# EAGLE design ESP32_EVKIT_v1.0 (EAGLE 6.5.0)
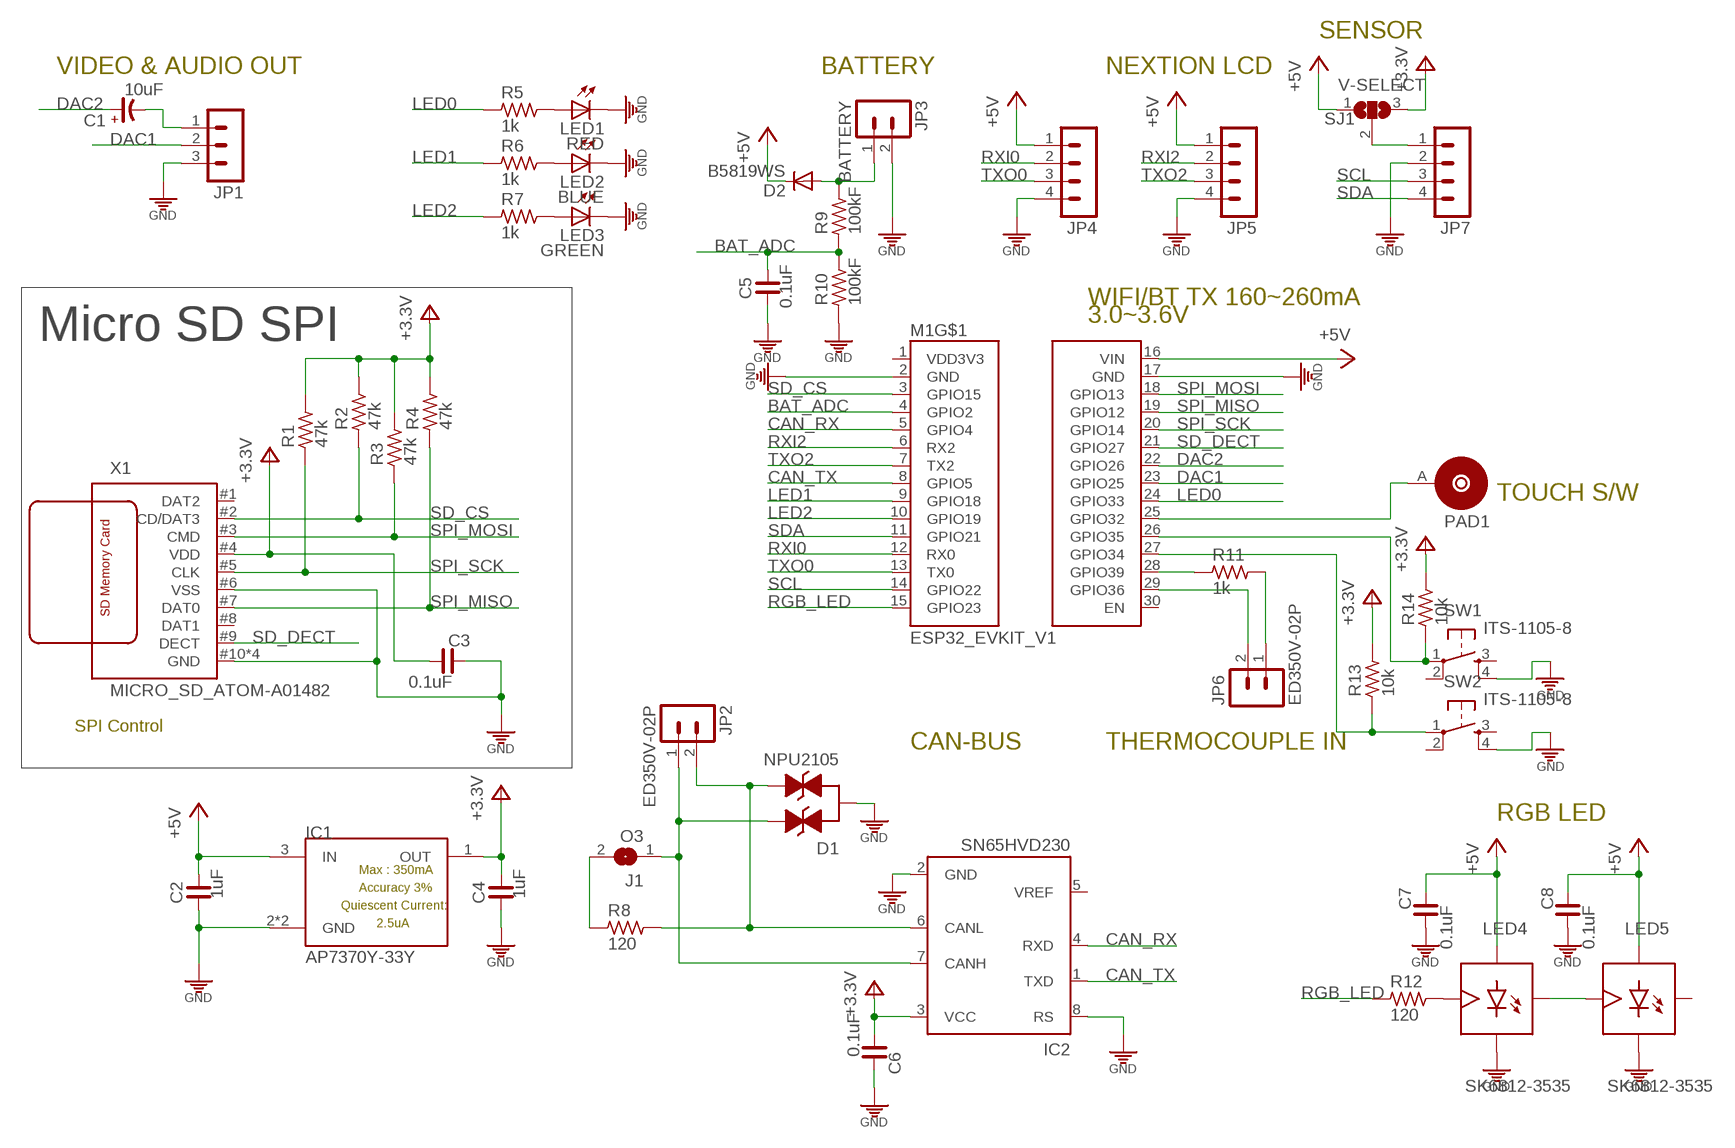
[diagram p0: schematic, sheet 1]

## Parts
C1  10uF  CP_2012  [C2012/T]
C2  1uF  C_0603  [C0603]
C3  0.1uF  C_0603  [C0603]
C4  1uF  C_0603  [C0603]
C5  0.1uF  C_0603  [C0603]
C6  0.1uF  C_0603  [C0603]
C7  0.1uF  C_0603  [C0603]
C8  0.1uF  C_0603  [C0603]
D1  NPU2105  [SOT23@2]
D2  B5819WS  B5189WWS  [SOD323-W]
IC1  AP7370Y-33Y  AP7370Y  [SOT89]
IC2  SN65HVD230  PCA82C250T  [SO8]
J1  O3  SJ  [SJ]
JP1  MA03-1DEF  [MA03]
JP2  ED350V-02P  MA02ED350V-02P  [ED350V-02P]
JP3  BATTERY  MA0253398  [53398-02]
JP4  MA04-1SMALL  [MA04-1-S]
JP5  MA04-1SMALL  [MA04-1-S]
JP6  ED350V-02P  MA02ED350V-02P  [ED350V-02P]
JP7  MA04-1SMALL  [MA04-1-S]
LED1  RED  LEDSMD-1608  [LED-1608]
LED2  BLUE  LEDSMD-1608  [LED-1608]
LED3  GREEN  LEDSMD-1608  [LED-1608]
LED4  SK6812-3535  SK68123535  [LED3535]
LED5  SK6812-3535  SK68123535  [LED3535]
M1  ESP32_EVKIT_V1  [ESP32_DEVKIT_V1_DOIT]
PAD1  TOUCH_PAD01  [TOUCH_PAD1]
R1  47k  R_0603  [R0603]
R2  47k  R_0603  [R0603]
R3  47k  R_0603  [R0603]
R4  47k  R_0603  [R0603]
R5  1k  R_0603  [R0603]
R6  1k  R_0603  [R0603]
R7  1k  R_0603  [R0603]
R8  120  R_0603  [R0603]
R9  100kF  R_0603  [R0603]
R10  100kF  R_0603  [R0603]
R11  1k  R_0603  [R0603]
R12  120  R_0603  [R0603]
R13  10k  R_0603  [R0603]
R14  10k  R_0603  [R0603]
SJ1  V-SELECT  SOLDERJUMPER_2WAYS  [SJ_3]
SW1  ITS-1105-8  ITS-1105  [ITS-1105]
SW2  ITS-1105-8  ITS-1105  [ITS-1105]
X1  MICRO_SD_ATOM-A01482  [ATOM-A01482]

## Nets
3V3: C3.2 C4.1 C6.2 IC1.1(OUT) IC2.3(VCC) R1.2 R2.2 R3.2 R4.2 R13.2 R14.2 SJ1.3 X1.#4(VDD) ; supply symbol labelled +3V3
+5V: C2.1 C7.1 C8.1 D2.C IC1.3(IN) JP4.1 JP5.1 LED4.4(VDD) LED5.4(VDD) M1.16(VIN) SJ1.1
BAT_ADC: C5.1 M1.4(GPIO2) R9.1 R10.2
CAN_RX: IC2.4(RXD) M1.5(GPIO4)
CAN_TX: IC2.1(TXD) M1.8(GPIO5)
CANH: D1.G(PIN1) IC2.7(CANH) J1.1 JP2.1
CANL: D1.S(PIN2) IC2.6(CANL) JP2.2 R8.2
DAC1: JP1.2 M1.23(GPIO25)
DAC2: C1.+ M1.22(GPIO26)
GND: C2.2 C3.1 C4.2 C5.2 C6.1 C7.2 C8.2 D1.D(PIN3) IC1.2(GND) IC1.2@1(GND) IC2.2(GND) IC2.8(RS) JP1.3 JP3.2 JP4.4 JP5.4 JP7.2 LED1.C LED2.C LED3.C LED4.2(VSS) LED5.2(VSS) M1.2(GND) M1.17(GND) R10.1 SW1.4 SW2.4 X1.#6(VSS) X1.#10(GND) X1.#10@1(GND) X1.#10@(GND) X1.#13(GND)
LED0: M1.24(GPIO33) R5.1
LED1: M1.9(GPIO18) R6.1
LED2: M1.10(GPIO19) R7.1
N$1: LED4.3(DIN) R12.2
N$2: LED1.A R5.2
N$3: LED2.A R6.2
N$4: LED3.A R7.2
N$5: M1.25(GPIO32) PAD1.A
N$6: J1.2 R8.1
N$7: M1.28(GPIO39) R11.1
N$8: LED4.1(DOUT) LED5.3(DIN)
N$9: JP6.2 M1.29(GPIO36)
N$10: D2.A JP3.1 R9.2
N$12: JP6.1 R11.2
N$14: C1.- JP1.1
N$15: JP7.1 SJ1.2
N$34: M1.26(GPIO35) R14.1 SW1.1
N$35: M1.27(GPIO34) R13.1 SW2.1
RGB_LED: M1.15(GPIO23) R12.1
RXI0: JP4.2 M1.12(RX0)
RXI2: JP5.2 M1.6(RX2)
SCL: JP7.3 M1.14(GPIO22)
SD_CS: M1.3(GPIO15) R2.1 X1.#2(CD/DAT3)
SD_DECT: M1.21(GPIO27) X1.#9(DECT)
SDA: JP7.4 M1.11(GPIO21)
SPI_MISO: M1.19(GPIO12) R4.1 X1.#7(DAT0)
SPI_MOSI: M1.18(GPIO13) R3.1 X1.#3(CMD)
SPI_SCK: M1.20(GPIO14) R1.1 X1.#5(CLK)
TXO0: JP4.3 M1.13(TX0)
TXO2: JP5.3 M1.7(TX2)
Unconnected: IC2.5(VREF) LED5.1(DOUT) M1.1(VDD3V3) M1.30(EN) SW1.2 SW1.3 SW2.2 SW2.3 X1.#1(DAT2) X1.#8(DAT1)

## Notes on the sheet
- SENSOR
- VIDEO & AUDIO OUT | BATTERY | NEXTION LCD
- WIFI/BT TX 160~260mA
- 3.0~3.6V
- Micro SD SPI
- TOUCH S/W
- SPI Control
- CAN-BUS | THERMOCOUPLE IN
- RGB LED

## Library data of the parts
C1 = cona_lib:CP_: POLARIZED CAP
C2-C8 = cona_lib:C_: NON-POLARIZED CAP
D1 = cona_lib:NPU2105
D2 = cona_lib:B5189W
IC1 = cona_lib:AP7370
IC2 = cona_lib:PCA82C250: CAN CONTROLLER INTERFACE
J1 = cona_lib:SJ: SMD solder JUMPER
JP1 = cona_lib:MA03-1: PIN HEADER
JP2 JP3 JP6 = cona_lib:MA02
JP4 JP5 JP7 = cona_lib:MA04-1: PIN HEADER
LED1-LED3 = cona_lib:LED: LED OSRAM: - CHIPLED LG R971, LG N971, LY N971, LG Q971, LY Q971, LO R971, LY R971 LH N974, LH R974 LS Q976, LO Q976, LY Q976 LO Q996 - Hyper CHIPLED LW Q18S LB Q993, LB Q99A, LB R99A - SideLED LS A670, LO A670, LY A670, LG A670, LP A670 LB A673, LV A673, LT A673, LW A673 LH A674 LY A675 LS A676, LA A676, LO A676, LY A676, LW A676 LS A679, LY A679, LG A679 - Hyper Micro SIDELED® LS Y876, LA Y876, LO Y876, LY Y876 LT Y87S - SmartLED LW L88C, LW L88S LB L89C, LB L89S, LG L890 LS L89K, LO L89K, LY L89K LS L896, LA L896, LO L896, LY L896 - TOPLED LS T670, LO T670, LY T670, LG T670, LP T670 LSG T670, LSP T670, LSY T670, LOP T670, LYG T670 LG T671, LOG T671, LSG T671 LB T673, LV T673, LT T673, LW T673 LH T674 LS T676, LA T676, LO T676, LY T676, LB T676, LH T676, LSB T676, LW T676 LB T67C, LV T67C, LT T67C, LS T67K, LO T67K, LY T67K, LW E67C LS E67B, LA E67B, LO E67B, LY E67B, LB E67C, LV E67C, LT E67C LW T67C LS T679, LY T679, LG T679 LS T770, LO T770, LY T770, LG T770, LP T770 LB T773, LV T773, LT T773, LW T773 LH T774 LS E675, LA E675, LY E675, LS T675 LS T776, LA T776, LO T776, LY T776, LB T776 LHGB T686 LT T68C, LB T68C - Hyper Mini TOPLED® LB M676 - Mini TOPLED Santana® LG M470 LS M47K, LO M47K, LY M47K Source: http://www.osram.convergy.de LUXEON: - LUMILED® LXK2-PW12-R00, LXK2-PW12-S00, LXK2-PW14-U00, LXK2-PW14-V00 LXK2-PM12-R00, LXK2-PM12-S00, LXK2-PM14-U00 LXK2-PE12-Q00, LXK2-PE12-R00, LXK2-PE12-S00, LXK2-PE14-T00, LXK2-PE14-U00 LXK2-PB12-K00, LXK2-PB12-L00, LXK2-PB12-M00, LXK2-PB14-N00, LXK2-PB14-P00, LXK2-PB14-Q00 LXK2-PR12-L00, LXK2-PR12-M00, LXK2-PR14-Q00, LXK2-PR14-R00 LXK2-PD12-Q00, LXK2-PD12-R00, LXK2-PD12-S00 LXK2-PH12-R00, LXK2-PH12-S00 LXK2-PL12-P00, LXK2-PL12-Q00, LXK2-PL12-R00 Source: www.luxeon.com KINGBRIGHT: KA-3528ASYC Source: www.kingbright.com
LED4 LED5 = cona_lib:SK6812
M1 = cona_lib:ESP32_EVKIT_V1
PAD1 = cona_lib:TOUCH_PAD
R1-R14 = cona_lib:R_: RESISTOR
SJ1 = DIYdrones3:SOLDERJUMPER_2WAY: Solder Jumper 2 way solder jumper
SW1 SW2 = switch-tact:ITS-1105
X1 = cona_lib:MICRO_SD_ATOM-A01482

## Net classes
0 default: clearance 0.152 mm
1 vcc: clearance 0.2 mm
2 GND: width 0.2 mm, clearance 0.152 mm

## Board
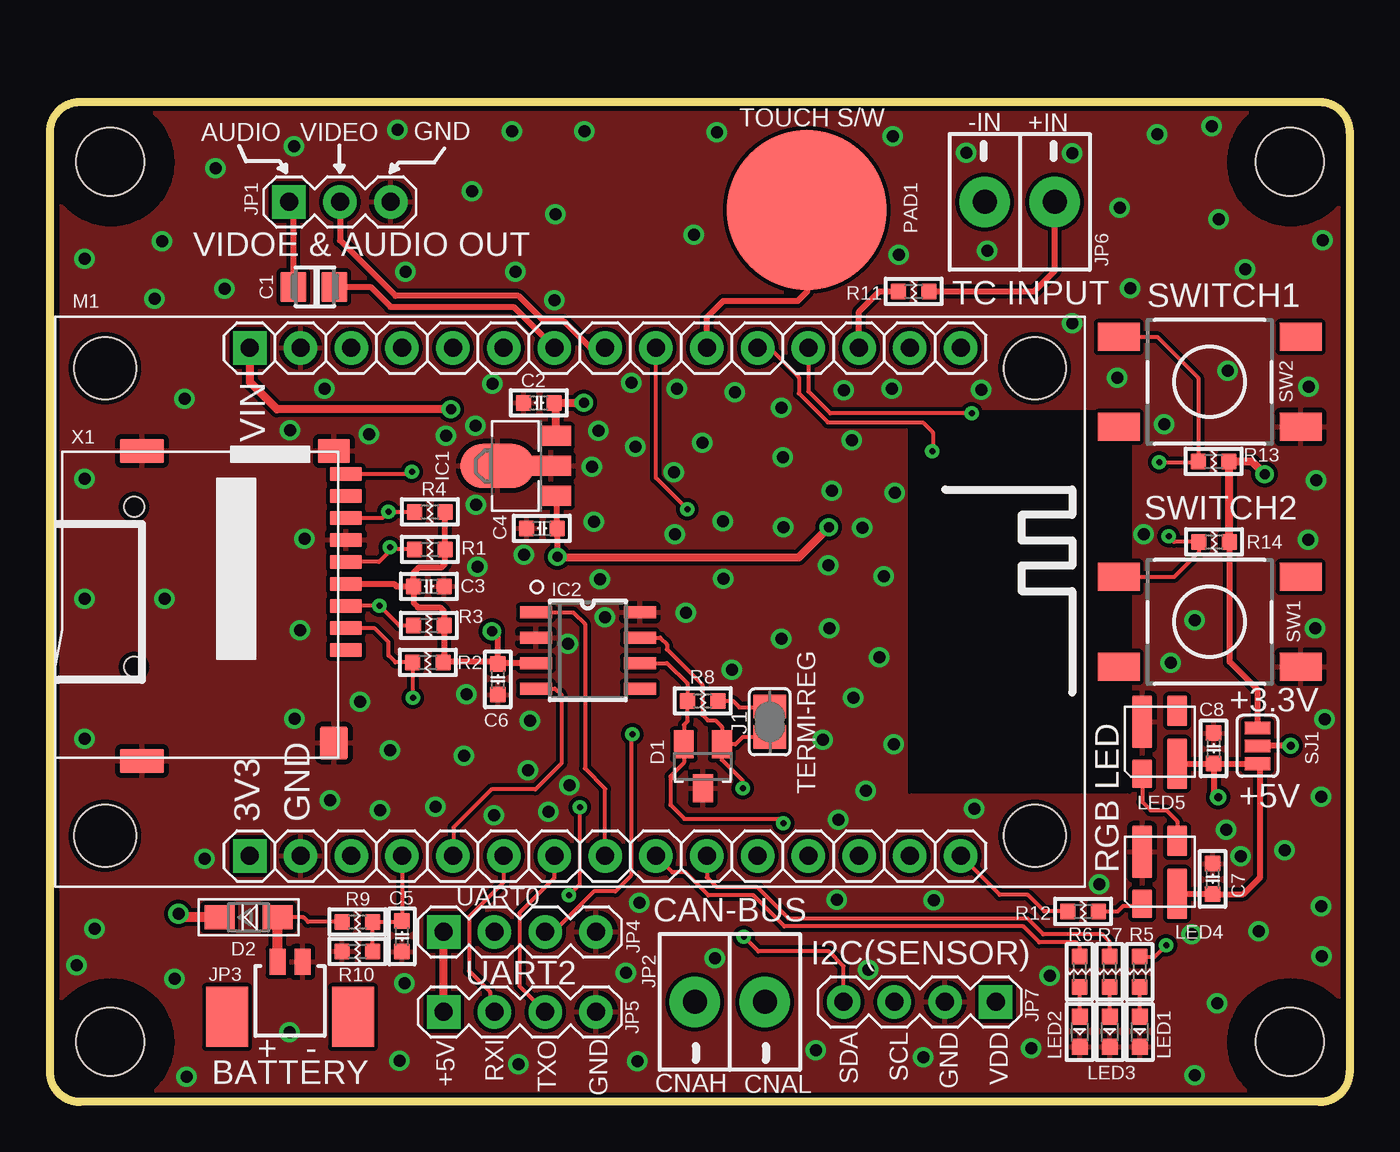
[diagram p1: board, top side]
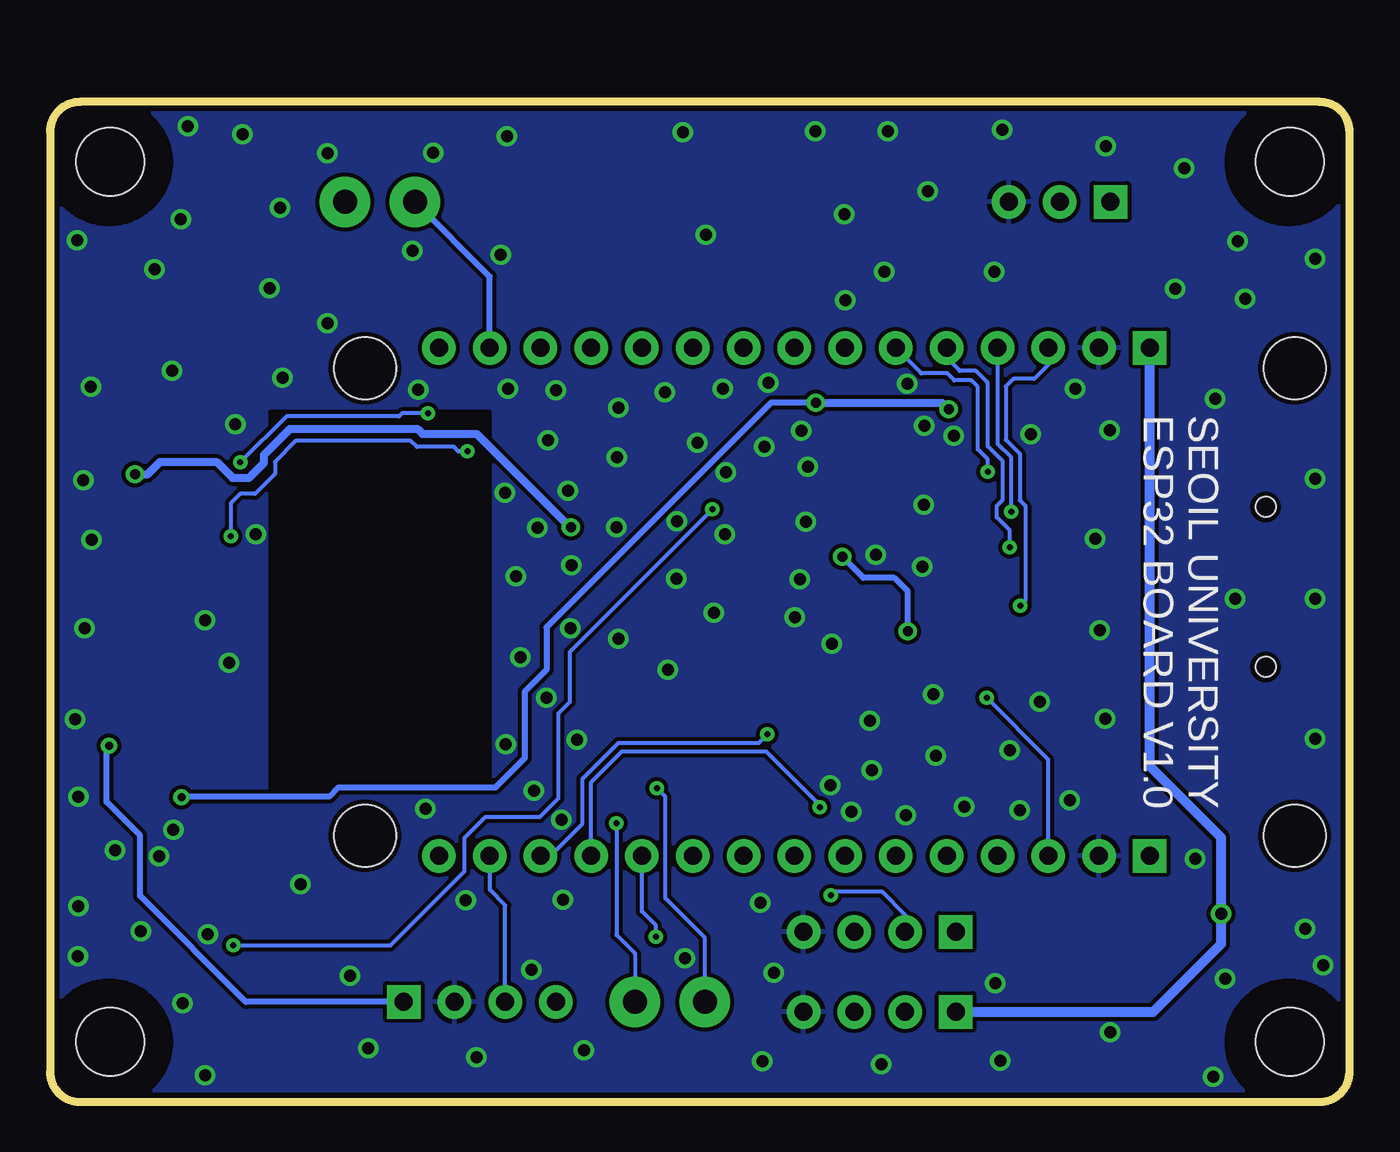
[diagram p2: board, bottom side, seen from below]

Size 65 x 50 mm. Coordinates in mm from the lower left corner, seen from the top.
Outline: 0,1.5 0,48.5 arc-90 1.5,50 63.5,50 arc-90 65,48.5 65,1.5 arc-90 63.5,0 1.5,0 arc-90 0,1.5
Copper layers (1+16): Top 0.035mm / dielectric 1.5mm / Bottom 0.035mm
Design rules "default *": minimum track width 0.2mm, minimum drill 0.3mm, track to track 0.2mm, track to pad 0.2mm, pad to pad 0.2mm, via to via 0.2mm, smd to smd 0.2mm, copper to edge 10mil, drill to drill 0.2mm, minimum pad ring 10mil, minimum via ring 8mil, stop-mask expansion 4mil, vias tented up to drill 1mm, thermal gap 10mil
Holes 3.4 mm at 3,47 62,47 62,3 3,3

### Footprints (pad centres in the part's own frame; a part is rotated, then mirrored left to right if it is on the bottom)
C2012/T = smd 1.3 x 1.5: + 1.016,0; - -1.016,0
C0603 = smd 0.8 x 0.8: 1 -0.762,0; 2 0.762,0
SOT23@2 = smd 1 x 1.4: D 0,-1.1; G 0.95,1.1; S -0.95,1.1
SOD323-W = smd 1.5 x 1.2: A 1.45,0; C -1.45,0
SOT89 = smd 1 x 1.5: 1 -1.499,-1.981; 3 1.499,-1.981 | smd 1 x 2: 2 0,-1.727 | smd 2.2 x 3.7: 2@1 0,0.94
SO8 = smd 0.6 x 1.6: 1 -1.905,-2.6; 2 -0.635,-2.6; 3 0.635,-2.6; 4 1.905,-2.6; 5 1.905,2.6; 6 0.635,2.6; 7 -0.635,2.6; 8 -1.905,2.6
SJ = smd 1.168 x 1.6: 1 -0.762,0; 2 0.762,0
MA03 = drill 0.9 pad 1.676 square: 1 -2.54,0 | drill 0.9 pad 1.676: 2 0,0; 3 2.54,0
ED350V-02P = drill 1.2 pad 2.54: 1 -1.75,0; 2 1.75,0
53398-02 = smd 0.8 x 1.3: 1 -0.625,0; 2 0.625,0 | smd 2.1 x 3: P$1 -3.15,-2.75; P$2 3.15,-2.75
MA04-1-S = drill 0.9 pad 1.676 square: 1 -3.81,0 | drill 0.9 pad 1.676: 2 -1.27,0; 3 1.27,0; 4 3.81,0
LED-1608 = smd 0.8 x 0.8: A -0.75,0; C 0.75,0
LED3535 = smd 1.5 x 1: 1 -1.55,0.875 | smd 2.6 x 1: 2 -1,-0.875 | smd 1.4 x 1: 3 1.6,-0.875 | smd 2.5 x 1: 4 1.1,0.875
ESP32_DEVKIT_V1_DOIT = drill 0.9 pad 1.676 square: 1 -12.7,16.01; 16 12.7,16.01 | drill 0.9 pad 1.676: 2 -12.7,13.47; 3 -12.7,10.93; 4 -12.7,8.39; 5 -12.7,5.85; 6 -12.7,3.31; 7 -12.7,0.77; 8 -12.7,-1.77; 9 -12.7,-4.31; 10 -12.7,-6.85; 11 -12.7,-9.39; 12 -12.7,-11.93; 13 -12.7,-14.47; 14 -12.7,-17.01; 15 -12.7,-19.55; 17 12.7,13.47; 18 12.7,10.93; 19 12.7,8.39; 20 12.7,5.85; 21 12.7,3.31; 22 12.7,0.77; 23 12.7,-1.77; 24 12.7,-4.31; 25 12.7,-6.85; 26 12.7,-9.39; 27 12.7,-11.93; 28 12.7,-14.47; 29 12.7,-17.01; 30 12.7,-19.55 | hole 3.1: 11.685,-23.25; -11.685,-23.25; 11.685,23.25; -11.685,23.25
TOUCH_PAD1 = smd 8 x 8: A -0.75,0
R0603 = smd 0.8 x 0.8: 1 -0.762,0; 2 0.762,0
SJ_3 = smd 0.635 x 1.27: 1 -0.889,0; 2 0,0; 3 0.889,0
ITS-1105 = smd 2.1 x 1.4: 1 -4.55,2.25; 2 4.55,2.25; 3 -4.55,-2.25; 4 4.55,-2.25
ATOM-A01482 = smd 0.7 x 1.6: #1 2.2,0; #2 1.1,0; #3 0,0; #4 -1.1,0; #5 -2.2,0; #6 -3.3,0; #7 -4.4,0; #8 -5.5,0; #9 -6.6,0 | smd 1.2 x 1.6: #10 -7.75,-0.6 | smd 1.2 x 2.2: #10@ -7.75,-10.2; #10@1 7.75,-10.2 | smd 1.6 x 1.4: #13 6.85,-0.6 | hole 1: -4.95,-10.6; 3.05,-10.6

### Placement (x,y rotation side)
C1  13.2,40.75 0 top
C2  24.45,34.95 180 top
C3  18.95,25.77 180 top
C4  24.6,28.68 180 top
C5  17.6,8.27 270 top
C6  22.4,21.12 90 top
C7  58.15,11.15 90 top
C8  58.2,17.68 90 top
D1  32.65,16.77 0 top
D2  9.93,9.22 0 top
IC1  23.32,31.8 90 top
IC2  26.9,22.57 270 top
J1  36,19 90 top
JP1  14.5,45 0 top
JP2  34,5 0 top
JP3  12,7 0 top
JP4  23.5,8.5 0 top
JP5  23.5,4.5 0 top
JP6  48.5,45 180 top
JP7  43.5,5 180 top
LED1  54.5,3.5 270 top
LED2  51.5,3.5 270 top
LED3  53,3.5 270 top
LED4  55.5,11.5 270 top
LED5  55.5,18 270 top
M1  26,25 90 top
PAD1  38.6,44.6 0 top
R1  19,27.62 0 top
R2  18.9,21.98 0 top
R3  18.95,23.82 0 top
R4  19,29.5 0 top
R5  54.5,6.5 270 top
R6  51.5,6.5 270 top
R7  53,6.5 270 top
R8  32.65,20.05 180 top
R9  15.38,9 180 top
R10  15.38,7.52 0 top
R11  43.2,40.52 0 top
R12  51.67,9.53 0 top
R13  58.2,32.02 0 top
R14  58.23,28 0 top
SJ1  60.4,17.8 90 top
SW1  58,24 0 top
SW2  58,36 0 top
X1  14.8,24.8 270 top

### Tracks (layer width: path | path; a pad name or v marks a point on that pad's centre or on a via)
3V3  (via drill 0.5)
  Top 0.3: X1.#4 17.2,25.9 17.32,25.77 C3.2 | C3.2 18.19,24.94 18.4,24.73 19.5,24.73 19.7,24.52 19.7,23.84 R3.2 19.71,22.02 | 19.71,22.02 R2.2 | R4.2 R1.2 19.75,26.9 19.57,26.73 18.45,26.73 18.19,26.46 C3.2 | 19.71,22.02 22.26,22.02 C6.2 | IC2.3 22.45,21.94 C6.2 | C6.2 22.4,23.23 v22.1,23.52 | v25.38,27.25 25.38,28.66 C4.1 25.36,30.25 IC1.1 | SJ1.3 60.4,20.6 59,22 59,27.99 R14.2
  Top 0.4: R14.2 58.96,28.02 R13.2 60.1,32.02 v60.75,31.38 | v25.38,27.25 25.4,27.23 37.45,27.23 v38.95,28.73
  Bottom 0.3: v22.1,23.52 22.1,25.52 22.77,26.2 24.32,26.2 v25.38,27.25
  Bottom 0.4: v38.95,28.73 39,28.73 43.67,33.4 46.38,33.4 46.62,33.65 53,33.65 54.3,32.35 54.3,31.95 55.05,31.2 55.88,31.2 56.67,32 59.5,32 60.12,31.38 v60.75,31.38
+5V  (via drill 0.4, 0.5, 0.6)
  Top 0.3: LED4.4 58.14,10.4 C7.1 59.69,10.39 60.52,11.22 60.52,16.79 SJ1.1 C8.1 | LED5.4 58.19,16.9 C8.1 | C8.1 58.2,15.45 v58.42,15.22
  Top 0.4: IC1.3 25.31,34.86 C2.1 v26.7,34.95 | v20.05,34.62 11.35,34.62 10,35.98 M1.16 | JP5.1 JP4.1
  Top 0.5: D2.C 6.6,9.22 v6.42,9.4
  Bottom 0.3: v26.7,34.95 28.95,34.95 40.17,23.73 40.17,21.6 41.25,20.52 41.25,17.2 42.73,15.72 50.58,15.72 51.02,15.28 58.38,15.28 v58.42,15.22
  Bottom 0.4: v26.7,34.95 20.38,34.95 v20.05,34.62
  Bottom 0.5: M1.16 10,16.77 6.42,13.2 v6.42,9.4 6.42,7.9 9.82,4.5 JP5.1
BAT_ADC
  Top 0.2: R10.2 R9.1 17.56,9 C5.1 M1.4
CAN_RX
  Top 0.2: IC2.4 25.25,20.67 25.57,20.35 25.57,16.93 24.27,15.62 22.07,15.62 20.18,13.72 20.18,12.32 M1.5
CAN_TX
  Top 0.2: M1.8 27.77,15.65 26.75,16.68 26.75,23.9 26.17,24.48 IC2.1
CANH  (via drill 0.3)
  Top 0.2: v34.65,15.68 34.65,16.05 33.6,17.1 D1.G | IC2.7 30.52,23.21 30.85,22.88 30.85,22.62 32.62,20.85 32.62,19.35 32.9,19.07 33.27,19.07 33.6,18.75 D1.G | J1.1 34.64,18.24 34.27,17.88 D1.G
  Bottom 0.2: JP2.1 32.25,8.2 34.23,10.18 34.23,15.25 v34.65,15.68
CANL  (via drill 0.3)
  Top 0.2: IC2.6 30.86,21.94 31.88,20.93 31.88,20.06 R8.2 31.89,19.04 31.7,18.85 D1.S 31.7,16.95 31.02,16.27 31.02,14.85 31.73,14.15 36.45,14.15 v36.67,13.93
  Bottom 0.2: v36.67,13.93 36.67,8.35 35.75,7.43 JP2.2
DAC1
  Top 0.3: JP1.2 14.5,43.08 17.27,40.3 23.43,40.3 24.7,39.02 25.7,39.02 27.02,37.7 M1.23
DAC2
  Top 0.3: C1.+ 16.02,40.75 17.02,39.75 23.18,39.75 M1.22
GND  (via drill 0.6)
  other vias: 15.5,20 7.72,12.15 2.23,8.65 6.22,6.15 1.73,18.15 5.72,25.15 12.72,28.15 12.22,19.15 1.73,31.15 1.73,25.15 6.72,35.15 1.73,42.15 8.72,40.65 13.72,35.65 15.95,33.38 12,33.58 12.5,23.57 8.28,46.67 17.38,48.6 12.2,47.77 21.1,45.52 17.77,41.5 19.8,33.3 21.27,33.8 21.3,29.85 23.7,27.35 27.1,31.75 27.43,33.55 27.2,29 29.27,32.75 29.07,35.95 22.12,35.9 23.27,41.5 25.23,40.08 23.1,48.52 26.73,48.52 25.27,44.38 5.6,43.02 14,15.07 16.5,14.57 17,17.57 20.82,20.38 24,19.05 19.27,14.75 20.7,17.3 23.9,16.57 22.2,14.32 25.98,15.82 24.93,14.5 25.9,22.9 27.75,24.23 21.38,26.75 27.5,26.12 31.8,24.45 33.67,26.15 34.1,21.6 36.58,23.15 31.25,28.38 33.65,29.02 31.2,31.48 31.35,35.65 32.62,32.95 36.67,28.73 36.65,32.23 34.25,35.48 39.1,30.55 32.2,43.35 33.35,48.48 42.15,48.27 42.45,42.35 46.88,42.55 51.12,47.42 45.83,47.45 55.38,48.38 53.5,44.7 58.45,44.12 58.1,48.77 63.65,43.08 54.02,40.67 59.77,41.62 62.95,35.75 63.33,31.07 62.92,28.1 63.27,23.68 57.25,24.07 53.38,36.2 58.9,36.55 55.73,33.88 40.1,33.08 39.7,35.58 46.58,35.6 42.1,35.65 51.12,38.92 42.25,30.45 38.98,23.68 38.92,26.82 40.62,28.7 41.48,22.23 40.17,20.2 40.8,15.55 39.42,14.1 46.23,14.65 52.48,10.88 58.83,13.6 56.05,21.95 63.75,19.12 63.58,15.25 59.55,12.28 61.75,12.57 63.58,9.78 63.6,7.27 60.45,8.52 57.1,8.38 58.38,4.93 57.25,1.32 50,6.3 49.08,2.68 44.2,10.07 39.35,10.1 40.92,6.6 33.25,7.18 29.48,9.95 28.8,6.45 29.38,2.02 38.3,2.57 43.67,2.23 11.97,3.48 17.48,2.05 17.73,5.93 23.43,1.88 6.83,1.25 1.32,6.82 38.65,18.1 36.58,34.7 41.7,26.27 42.2,17.88 54.7,28.38 5.22,40.15
  pour Bottom (rank 3): 0,50 65,50 65,0 0,0
  pour Top (rank 3): 0,50 65,50 65,0 0,0
LED0  (via drill 0.3)
  Top 0.2: R5.1 55.26,7.26 v55.83,7.82 | v31.88,29.62 30.3,31.2 M1.24
  Bottom 0.2: v31.88,29.62 39,22.5 39,20 39.58,19.43 39.58,15.18 40.5,14.25 43.23,14.25 44.27,13.2 44.27,11.53 47.98,7.82 v55.83,7.82
LED1
  Top 0.2: R6.1 51.5,7.8 51.33,7.98 49.48,7.98 48.67,8.77 36.73,8.77 35.17,10.32 32.92,10.32 31.77,11.47 31.14,11.47 M1.9
LED2
  Top 0.2: M1.10 32.85,11.22 33.33,10.75 35.35,10.75 36.92,9.18 48.88,9.18 49.67,8.38 52.62,8.38 53,8 R7.1
N$1
  Top 0.2: R12.2 53.4,9.53 53.67,9.8 54.52,9.8 LED4.3
N$2
  Top 0.2: LED1.A R5.2
N$3
  Top 0.2: LED2.A R6.2
N$4
  Top 0.2: LED3.A R7.2
N$5
  Top 0.3: M1.25 32.85,39.23 33.67,40.05 37.4,40.05 37.88,40.52 37.88,44.58 PAD1.A
N$6
  Top 0.2: R8.1 34.15,20.05 34.48,19.73 35.46,19.73 J1.2
N$7
  Top 0.3: M1.28 40.47,39.52 41.48,40.52 R11.1
N$8
  Top 0.2: LED5.3 54.62,15 55.05,14.57 55.83,14.57 56.38,14.03 LED4.1
N$9
  Bottom 0.3: M1.29 43.01,41.26 JP6.2
N$10
  Top 0.2: R9.2 12.9,9 12.68,9.22 D2.A
  Top 0.5: JP3.1 D2.A
N$12
  Top 0.3: R11.2 49.23,40.52 50.25,41.55 JP6.1
N$13
  cutout Top: 3.05,5.98 arc90 0.05,2.98 arc90 3.05,-0.02 arc90 6.05,2.98 arc90
  cutout Bottom: 3.05,5.98 arc90 0.05,2.98 arc90 3.05,-0.02 arc90 6.05,2.98 arc90
N$14
  Top 0.3: C1.- 12.18,44.78 JP1.1
N$15  (via drill 0.4)
  Top 0.3: v62.05,17.8 SJ1.2
  Bottom 0.3: JP7.1 55.2,5 60.5,10.3 60.5,13.32 62.17,15 62.17,17.68 v62.05,17.8
N$16
  cutout Bottom: 46.5,34.5 54,34.5 54,15.5 43,15.5 43,34.5
  cutout Top: 46.5,34.5 54,34.5 54,15.5 43,15.5 43,34.5
N$17
  cutout Top: 62.05,49.98 arc90 59.05,46.98 arc90 62.05,43.98 arc90 65.05,46.98 arc90
  cutout Bottom: 62.05,49.98 arc90 59.05,46.98 arc90 62.05,43.98 arc90 65.05,46.98 arc90
N$18
  cutout Top: 3.05,49.98 arc90 0.05,46.98 arc90 3.05,43.98 arc90 6.05,46.98 arc90
  cutout Bottom: 3.05,49.98 arc90 0.05,46.98 arc90 3.05,43.98 arc90 6.05,46.98 arc90
N$19
  cutout Top: 62.05,5.98 arc90 59.05,2.98 arc90 62.05,-0.02 arc90 65.05,2.98 arc90
  cutout Bottom: 62.05,5.98 arc90 59.05,2.98 arc90 62.05,-0.02 arc90 65.05,2.98 arc90
N$34  (via drill 0.3)
  Top 0.2: SW1.1 56.23,26.25 57.46,27.49 R14.1 56.23,28 v55.95,28.27 | M1.26 35.98,37.7 37.45,36.23 37.45,35.42 38.9,33.98 43.65,33.98 44.15,33.48 44.15,32.55 v44.12,32.52
  Bottom 0.2: v44.12,32.52 44.58,32.52 44.8,32.75 46.65,32.75 46.95,33.05 52.7,33.05 53.75,32 53.75,31.4 54.75,30.4 55.48,30.4 55.95,29.93 v55.95,28.27
N$35  (via drill 0.3)
  Top 0.2: M1.27 37.93,35.52 39.03,34.42 v46.1,34.42 | v55.48,31.98 57.39,31.98 R13.1 57.42,32.04 57.42,36.2 55.38,38.25 SW2.1 53.4,38.3
  Bottom 0.2: v46.1,34.42 47.4,34.42 47.55,34.27 53.17,34.27 v55.48,31.98
RGB_LED
  Top 0.2: R12.1 49.73,9.53 48.9,10.35 47.5,10.35 M1.15
RXI0  (via drill 0.3)
  Top 0.2: 26,10.32 v25.95,10.32 26.5,10.88 v26.5,14.72
  Bottom 0.2: JP4.2 22.23,9.36 23.38,10.5 25.77,10.5 v25.95,10.32 | M1.12 37.93,15.99 36.4,17.52 29.2,17.52 26.5,14.82 v26.5,14.72
RXI2
  Top 0.2: M1.6 22.7,11 20.95,9.25 20.95,6.55 22,5.5 22,4.73 JP5.2
SCL
  Bottom 0.2: JP7.3 42.23,9.83 43,10.6 M1.14
SD_CS  (via drill 0.3)
  Top 0.2: X1.#2 16.2,23.7 16.93,22.98 16.93,22.32 17.27,21.98 R2.1 18.15,21.96 v18.15,20.2
  Bottom 0.2: M1.3 15.07,17.12 v18.15,20.2
SD_DECT  (via drill 0.3)
  Top 0.2: X1.#9 18,31.4 v18.1,31.5
  Bottom 0.2: M1.21 21.41,36.42 20.12,36.42 19.77,36.08 18.93,36.08 18.6,35.75 18.6,32.62 18.1,32.12 v18.1,31.5
SDA  (via drill 0.3)
  Top 0.2: JP7.4 39.69,6.79 38.95,7.52 35.42,7.52 v34.7,8.25
  Bottom 0.2: v34.7,8.25 34.7,8.82 35.4,9.53 M1.11
SPI_MISO  (via drill 0.3)
  Top 0.2: 18.25,29.51 R4.1 v16.93,29.5 16.62,29.2 X1.#7
  Bottom 0.2: M1.19 17.61,32.91 16.93,32.23 v16.93,29.5
SPI_MOSI  (via drill 0.3)
  Top 0.2: R3.1 17.45,23.82 v16.48,24.8 X1.#3
  Bottom 0.2: M1.18 15.07,36.86 15.78,36.15 16.82,36.15 17.2,35.77 17.2,33.1 16.5,32.4 16.5,30.07 16.23,29.8 16.23,25.05 v16.48,24.8
SPI_SCK  (via drill 0.3)
  Top 0.2: X1.#5 16.45,27 17,27.55 v17,27.73 17.1,27.62 R1.1
  Bottom 0.2: M1.20 20.15,37.2 19.5,36.55 18.7,36.55 18.1,35.95 18.1,32.77 17.35,32.02 17.35,30.1 17.65,29.8 17.65,29.23 17,28.57 v17,27.73
TXO0  (via drill 0.3)
  Top 0.2: JP4.3 25.18,8.5 27.2,10.53 28.27,10.53 29.05,11.3 29.05,18.27 29.12,18.35 v29.12,18.38
  Bottom 0.2: M1.13 39.98,12.3 38.38,13.9 38.38,16.15 36.58,17.95 29.55,17.95 v29.12,18.38
TXO2
  Top 0.2: M1.7 25.23,11.2 23.48,9.45 23.48,5.8 JP5.3

### Text on the board
_tPlace: TOUCH S/W | -IN | +IN | AUDIO | VIDEO | GND | VIDOE & AUDIO OUT | TC INPUT | SWITCH1 | SWITCH2 | TERMI-REG | +3.3V | +5V | RGB LED | UART0 | CAN-BUS | I2C(SENSOR) | UART2 | +5V | RXI | TXO | GND | SDA | SCL | GND | VDD | + - | BATTERY | CNAH | CNAL
_bPlace: SEOIL UNIVERSITY / ESP32 BOARD V1.0
t_silk_add: E- | S- | SWO | NRST | TXO | S+ | SWCLK | RXI | GND | - | + | - | E+ | SWDIO | 3.3V | 3.3V | GND